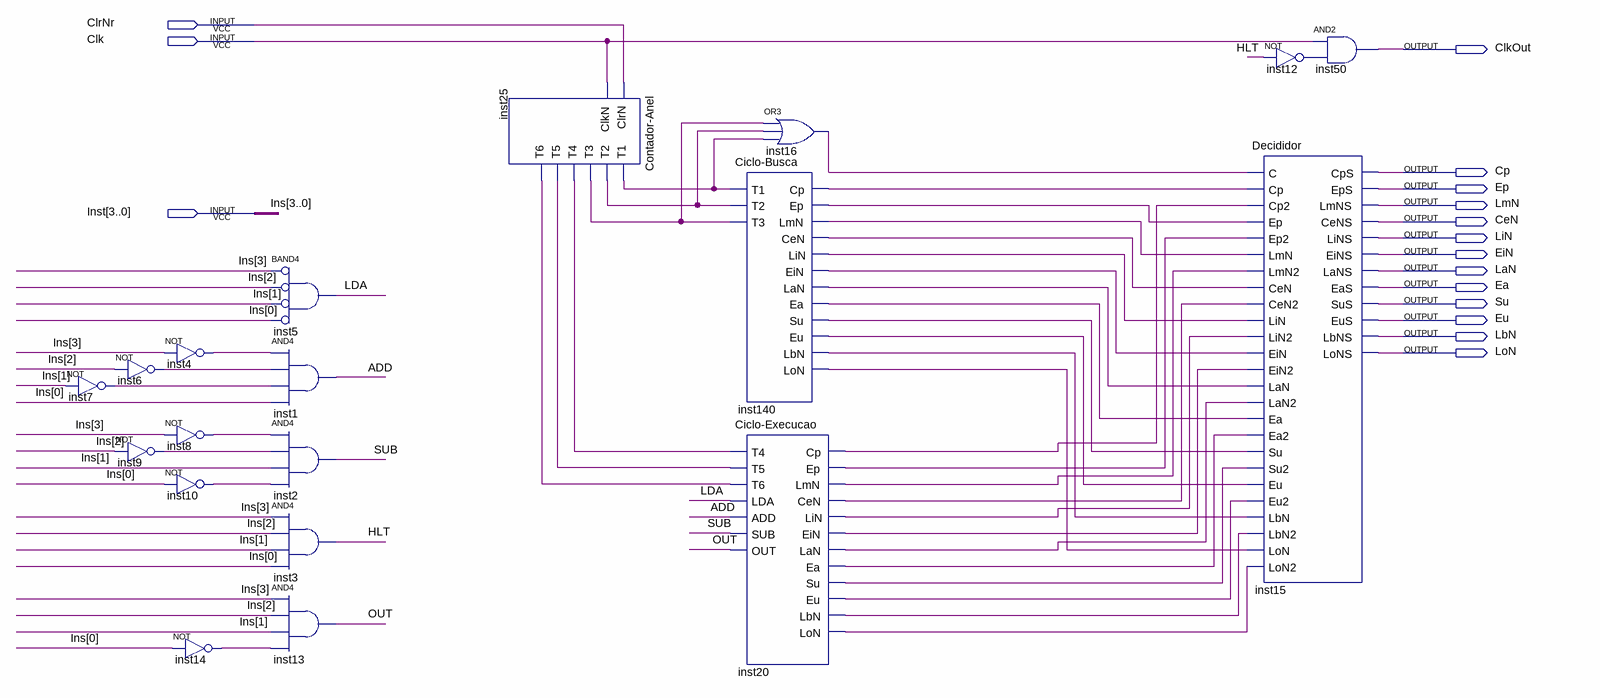
[diagram p0: schematic sheet]
// Quartus schematic Controlador.bdf as structural Verilog: 19 symbols, 16 pins
module Controlador (
  input  ClrNr,
  input  Clk,
  input  [3:0] Inst,
  output ClkOut,
  output Cp,
  output Ep,
  output LmN,
  output CeN,
  output LiN,
  output EiN,
  output LaN,
  output Ea,
  output Su,
  output Eu,
  output LbN,
  output LoN
);

  wire ADD, HLT, inst4_out, inst6_out, inst7_out, inst8_out, inst9_out, inst10_out, inst12_out, inst14_out,
       inst16_out, inst20_cen, inst20_cp, inst20_ea, inst20_ein, inst20_ep, inst20_eu, inst20_lan,
       inst20_lbn, inst20_lin, inst20_lmn, inst20_lon, inst20_su, inst25_t1, inst25_t2, inst25_t3, inst25_t4,
       inst25_t5, inst25_t6, inst140_cen, inst140_cp, inst140_ea, inst140_ein, inst140_ep, inst140_eu,
       inst140_lan, inst140_lbn, inst140_lin, inst140_lmn, inst140_lon, inst140_su, LDA, OUT, SUB;

  not inst6 (inst6_out, Inst[2]);
  not inst7 (inst7_out, Inst[1]);
  not inst9 (inst9_out, Inst[2]);
  not inst4 (inst4_out, Inst[3]);
  not inst8 (inst8_out, Inst[3]);
  not inst10 (inst10_out, Inst[0]);
  not inst14 (inst14_out, Inst[0]);
  and inst5 (LDA, ~Inst[3], ~Inst[2], ~Inst[1], ~Inst[0]);  // BAND4
  and inst1 (ADD, inst4_out, inst6_out, inst7_out, Inst[0]);
  and inst2 (SUB, inst8_out, inst9_out, Inst[1], inst10_out);
  and inst3 (HLT, Inst[3], Inst[2], Inst[1], Inst[0]);
  and inst13 (OUT, Inst[3], Inst[2], Inst[1], inst14_out);
  \Contador-Anel  inst25 (
    .ClrN(ClrNr), .ClkN(Clk), .T1(inst25_t1), .T2(inst25_t2), .T3(inst25_t3), .T4(inst25_t4), .T5(inst25_t5),
    .T6(inst25_t6));
  or inst16 (inst16_out, inst25_t3, inst25_t2, inst25_t1);
  \Ciclo-Busca  inst140 (
    .T1(inst25_t1), .T2(inst25_t2), .T3(inst25_t3), .Cp(inst140_cp), .Ep(inst140_ep), .LmN(inst140_lmn),
    .CeN(inst140_cen), .LiN(inst140_lin), .EiN(inst140_ein), .LaN(inst140_lan), .Ea(inst140_ea),
    .Su(inst140_su), .Eu(inst140_eu), .LbN(inst140_lbn), .LoN(inst140_lon));
  \Ciclo-Execucao  inst20 (
    .T4(inst25_t4), .T5(inst25_t5), .T6(inst25_t6), .LDA(LDA), .ADD(ADD), .SUB(SUB), .OUT(OUT),
    .Cp(inst20_cp), .Ep(inst20_ep), .LmN(inst20_lmn), .CeN(inst20_cen), .LiN(inst20_lin), .EiN(inst20_ein),
    .LaN(inst20_lan), .Ea(inst20_ea), .Su(inst20_su), .Eu(inst20_eu), .LbN(inst20_lbn), .LoN(inst20_lon));
  not inst12 (inst12_out, HLT);
  Decididor inst15 (
    .C(inst16_out), .Cp(inst140_cp), .Cp2(inst20_cp), .Ep(inst140_ep), .Ep2(inst20_ep), .LmN(inst140_lmn),
    .LmN2(inst20_lmn), .CeN(inst140_cen), .CeN2(inst20_cen), .LiN(inst140_lin), .LiN2(inst20_lin),
    .EiN(inst140_ein), .EiN2(inst20_ein), .LaN(inst140_lan), .LaN2(inst20_lan), .Ea(inst140_ea),
    .Ea2(inst20_ea), .Su(inst140_su), .Su2(inst20_su), .Eu(inst140_eu), .Eu2(inst20_eu), .LbN(inst140_lbn),
    .LbN2(inst20_lbn), .LoN(inst140_lon), .LoN2(inst20_lon), .CpS(Cp), .EpS(Ep), .LmNS(LmN), .CeNS(CeN),
    .LiNS(LiN), .EiNS(EiN), .LaNS(LaN), .EaS(Ea), .SuS(Su), .EuS(Eu), .LbNS(LbN), .LoNS(LoN));
  and inst50 (ClkOut, Clk, inst12_out);

  // Other names for the same wires on the sheet: Ins[3:0] = Inst
endmodule
